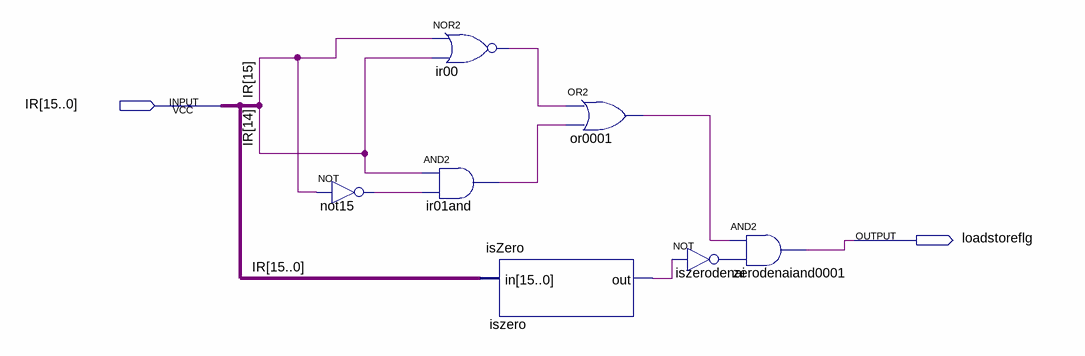
[diagram p0: schematic sheet]
// Quartus schematic comcheck-loadstore.bdf as structural Verilog: 7 symbols, 2 pins
module \comcheck-loadstore  (
  input  [15:0] IR,
  output loadstoreflg
);

  wire ir00_out, ir01and_out, iszero_out, iszerodenai_out, not15_out, or0001_out;

  not not15 (not15_out, IR[15]);
  and ir01and (ir01and_out, IR[14], not15_out);
  nor ir00 (ir00_out, IR[15], IR[14]);
  isZero iszero (.in(IR), .out(iszero_out));
  or or0001 (or0001_out, ir00_out, ir01and_out);
  and zerodenaiand0001 (loadstoreflg, or0001_out, iszerodenai_out);
  not iszerodenai (iszerodenai_out, iszero_out);
endmodule
